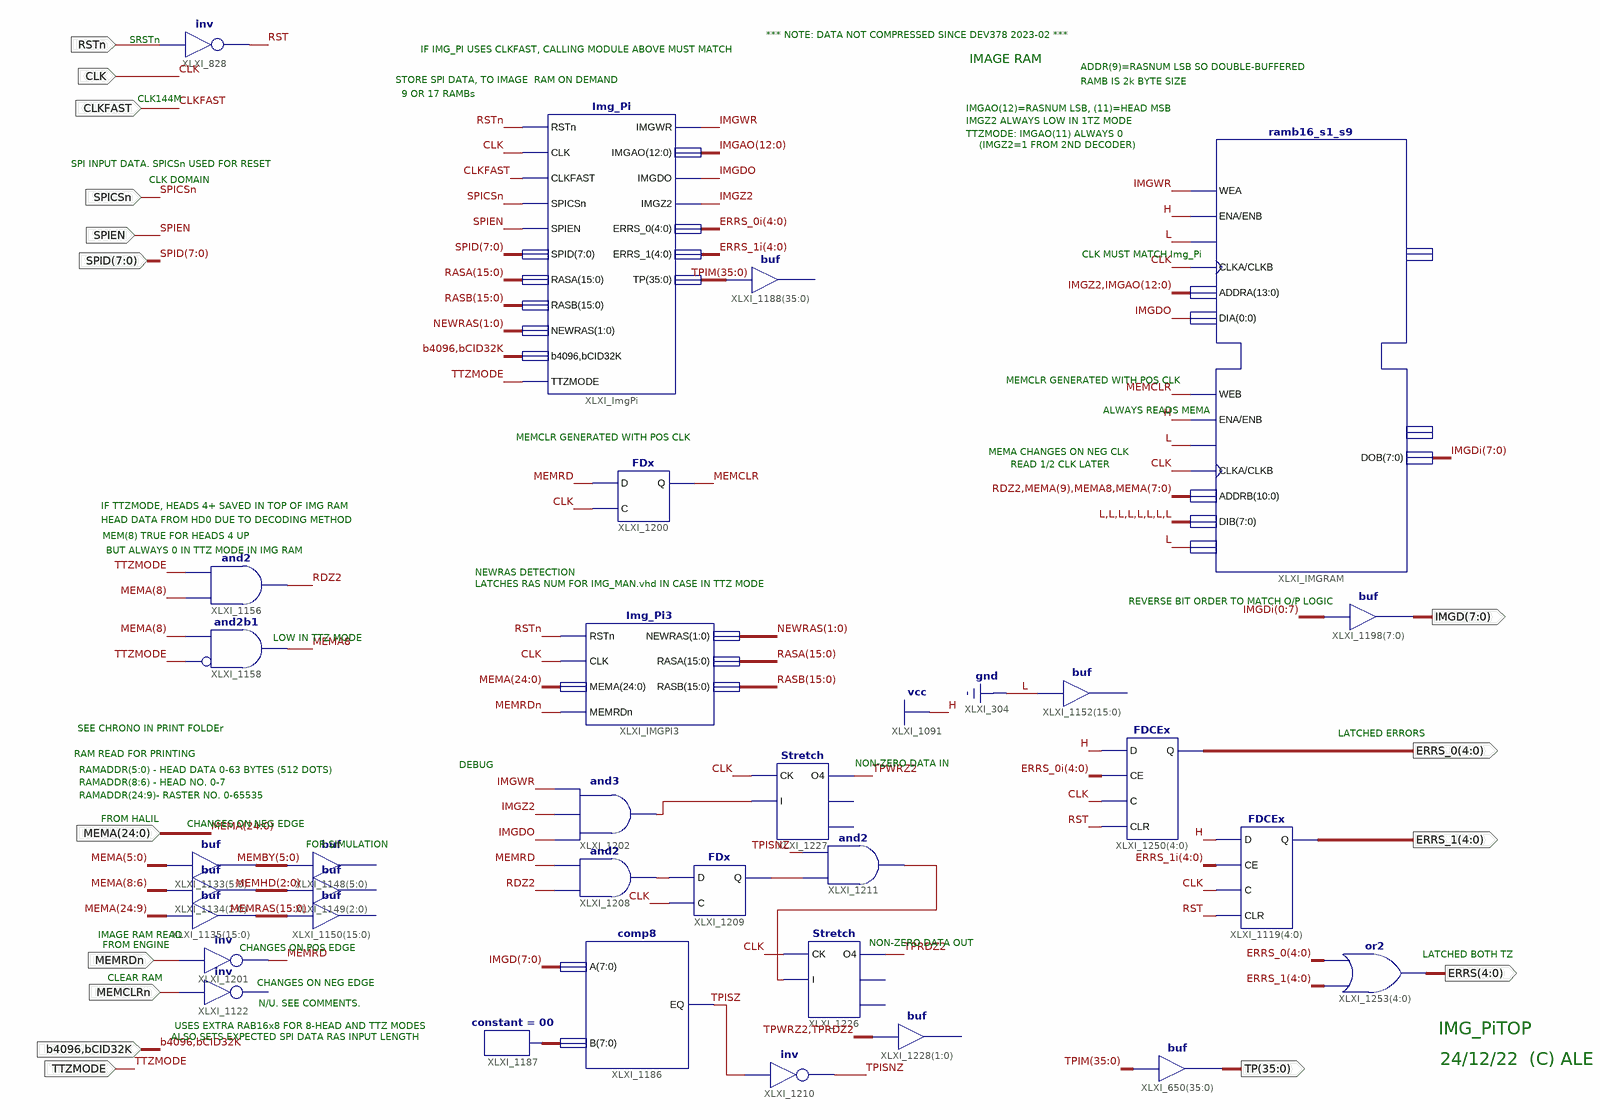
[diagram p0: schematic sheet 1]
// Xilinx ISE schematic Img_PiTop.sch (spartan6) as structural Verilog: 32 symbols, 16 ports
module Img_PiTop (
  input  SPICSn,
  input  CLK,
  input  SPIEN,
  input  [7:0] SPID,
  input  RSTn,
  input  [24:0] MEMA,
  input  MEMRDn,
  input  MEMCLRn,
  input  TTZMODE,
  input  CLKFAST,
  input  b4096,
  input  bCID32K,
  output [7:0] IMGD,
  output [35:0] TP,
  output [4:0] ERRS,
  output [4:0] ERRS_0,
  output [4:0] ERRS_1
);

  wire IMGDO, IMGWR, IMGZ2, MEMA8, MEMCLR, MEMRD, RDZ2, RST, TPISNZ, TPISZ, TPRDZ2, TPWRZ2, XLXN_31, XLXN_36,
       XLXN_79, XLXN_83;
  wire [1:0] NEWRAS;
  wire [2:0] MEMHD;
  wire [4:0] ERRS_0i, ERRS_1i;
  wire [5:0] MEMBY;
  wire [7:0] IMGDi, XLXN_4;
  wire [12:0] IMGAO;
  wire [15:0] MEMRAS, RASA, RASB;
  wire [35:0] TPIM;

  not XLXI_828 (RST, RSTn);
  assign MEMBY = MEMA[5:0];  // buf XLXI_1133[5..0], 6 bits wide
  assign MEMHD = MEMA[8:6];  // buf XLXI_1134[2..0], 3 bits wide
  assign MEMRAS = MEMA[24:9];  // buf XLXI_1135[15..0], 16 bits wide
  // buf XLXI_1150[15..0] has open pins: I=MEMRAS, O=open
  // buf XLXI_1149[2..0] has open pins: I=MEMHD, O=open
  // buf XLXI_1148[5..0] has open pins: I=MEMBY, O=open
  // inv XLXI_1122 has open pins: I=MEMCLRn, O=open
  and XLXI_1158 (MEMA8, ~TTZMODE, MEMA[8]);  // and2b1
  and XLXI_1156 (RDZ2, MEMA[8], TTZMODE);
  not XLXI_1201 (MEMRD, MEMRDn);
  FDx XLXI_1200 (.C(CLK), .D(MEMRD), .Q(MEMCLR));
  Img_Pi3 XLXI_IMGPI3 (.CLK(CLK), .MEMRDn(MEMRDn), .NEWRAS(NEWRAS), .MEMA(MEMA), .RASA(RASA), .RASB(RASB), .RSTn(RSTn));
  and XLXI_1202 (XLXN_83, IMGDO, IMGZ2, IMGWR);
  and XLXI_1208 (XLXN_31, RDZ2, MEMRD);
  FDx XLXI_1209 (.C(CLK), .D(XLXN_31), .Q(XLXN_36));
  comp8 XLXI_1186 (.A(IMGD), .B(XLXN_4), .EQ(TPISZ));
  constant #(.CValue("00")) XLXI_1187 (.O(XLXN_4));
  not XLXI_1210 (TPISNZ, TPISZ);
  and XLXI_1211 (XLXN_79, XLXN_36, TPISNZ);
  Stretch XLXI_1227 (.CK(CLK), .I(XLXN_83), .O4(TPWRZ2));  // open: O8, Q64
  Stretch XLXI_1226 (.CK(CLK), .I(XLXN_79), .O4(TPRDZ2));  // open: O8, Q64
  // buf XLXI_1228[1..0] has open pins: I={TPWRZ2, TPRDZ2}, O=open
  ramb16_s1_s9 XLXI_IMGRAM (
    .ADDRA({IMGZ2, IMGAO}), .ADDRB({RDZ2, MEMA[9], MEMA8, MEMA[7:0]}), .CLKA(CLK), .CLKB(CLK), .DIA(IMGDO),
    .DIB({8{1'b0}}), .DIPB(1'b0), .ENA(1'b1), .ENB(1'b1), .SSRA(1'b0), .SSRB(1'b0), .WEA(IMGWR),
    .WEB(MEMCLR), .DOB(IMGDi));  // open: DOA, DOPB
  assign IMGD = {IMGDi[0], IMGDi[1], IMGDi[2], IMGDi[3], IMGDi[4], IMGDi[5], IMGDi[6], IMGDi[7]};  // buf XLXI_1198[7..0], 8 bits wide
  // buf XLXI_1152[15..0] has open pins: I=1'b0, O=open
  assign TP = TPIM;  // buf XLXI_650[35..0], 36 bits wide
  FDCEx XLXI_1119[4:0] (.C(CLK), .CE(ERRS_1i), .CLR(RST), .D(1'b1), .Q(ERRS_1));
  FDCEx XLXI_1250[4:0] (.C(CLK), .CE(ERRS_0i), .CLR(RST), .D(1'b1), .Q(ERRS_0));
  assign ERRS = ERRS_1 | ERRS_0;  // or2 XLXI_1253[4..0], 5 bits wide
  // buf XLXI_1188[35..0] has open pins: I=TPIM, O=open
  Img_Pi XLXI_ImgPi (
    .CLK(CLK), .CLKFAST(CLKFAST), .ERRS_0(ERRS_0i), .ERRS_1(ERRS_1i), .b4096(b4096), .bCID32K(bCID32K),
    .IMGAO(IMGAO), .IMGDO(IMGDO), .IMGWR(IMGWR), .IMGZ2(IMGZ2), .NEWRAS(NEWRAS), .RASA(RASA), .RASB(RASB),
    .RSTn(RSTn), .SPICSn(SPICSn), .SPID(SPID), .SPIEN(SPIEN), .TP(TPIM), .TTZMODE(TTZMODE));

  // Notes on the sheet:
  //   *** NOTE: DATA NOT COMPRESSED SINCE DEV378 2023-02 ***
  //   SRSTn
  //   IF IMG_PI USES CLKFAST, CALLING MODULE ABOVE MUST MATCH
  //   IMAGE RAM
  //   ADDR(9)=RASNUM LSB SO DOUBLE-BUFFERED
  //   STORE SPI DATA, TO IMAGE  RAM ON DEMAND
  //   RAMB IS 2k BYTE SIZE
  //   9 OR 17 RAMBs
  //   CLK144M
  //   IMGAO(12)=RASNUM LSB, (11)=HEAD MSB
  //   IMGZ2 ALWAYS LOW IN 1TZ MODE
  //   TTZMODE: IMGAO(11) ALWAYS 0
  //   (IMGZ2=1 FROM 2ND DECODER)
  //   SPI INPUT DATA. SPICSn USED FOR RESET
  //   CLK DOMAIN
  //   CLK MUST MATCH Img_Pi
  //   MEMCLR GENERATED WITH POS CLK
  //   ALWAYS READS MEMA
  //   MEMCLR GENERATED WITH POS CLK
  //   MEMA CHANGES ON NEG CLK
  //   READ 1/2 CLK LATER
  //   IF TTZMODE, HEADS 4+ SAVED IN TOP OF IMG RAM
  //   HEAD DATA FROM HD0 DUE TO DECODING METHOD
  //   MEM(8) TRUE FOR HEADS 4 UP
  //   BUT ALWAYS 0 IN TTZ MODE IN IMG RAM
  //   NEWRAS DETECTION
  //   LATCHES RAS NUM FOR IMG_MAN.vhd IN CASE IN TTZ MODE
  //   REVERSE BIT ORDER TO MATCH O/P LOGIC
  //   LOW IN TTZ MODE
  //   SEE CHRONO IN PRINT FOLDEr
  //   LATCHED ERRORS
  //   RAM READ FOR PRINTING
  //   NON-ZERO DATA IN
  //   DEBUG
  //   RAMADDR(5:0) - HEAD DATA 0-63 BYTES (512 DOTS)
  //   RAMADDR(8:6) - HEAD NO. 0-7
  //   RAMADDR(24:9)- RASTER NO. 0-65535
  //   FROM HALIL
  //   CHANGES ON NEG EDGE
  //   FOR SIMULATION
  //   IMAGE RAM READ
  //   NON-ZERO DATA OUT
  //   FROM ENGINE
  //   CHANGES ON POS EDGE
  //   LATCHED BOTH TZ
  //   CLEAR RAM
  //   CHANGES ON NEG EDGE
  //   N/U. SEE COMMENTS.
  //   USES EXTRA RAB16x8 FOR 8-HEAD AND TTZ MODES
  //   IMG_PiTOP
  //   ALSO SETS EXPECTED SPI DATA RAS INPUT LENGTH
  //   24/12/22  (C) ALE
endmodule
